# Altium schematic sheet JTAG.SchDoc
size A
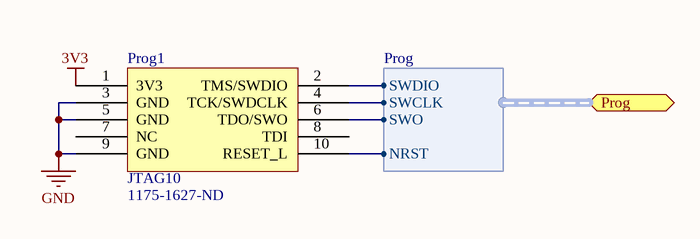
[diagram p0: JTAG.SchDoc]

## Parts
Prog1  JTAG10  Supplier Part Number 1: 1175-1627-ND  [JTAG10 Polarity]

## Ports
Prog (harness Prog)

## Harnesses
Prog: NRST, SWCLK, SWDIO, SWO

## Nets
3V3: Prog1.1(3V3)
GND: Prog1.3(GND) Prog1.5(GND) Prog1.9(GND)
NetProg1_2: Prog1.2(TMS/SWDIO) ; port Prog.SWDIO
NetProg1_4: Prog1.4(TCK/SWDCLK) ; port Prog.SWCLK
NetProg1_6: Prog1.6(TDO/SWO) ; port Prog.SWO
NetProg1_10: Prog1.10(RESET_L) ; port Prog.NRST

Not connected (* = marked no-connect by the designer): Prog1 7(NC) 8(TDI)

## Library data of the parts
Prog1 = JTAG10: 3220-10-0100-00; Supplier 1: Digi-Key